# Altium schematic sheet Top Sheet.SchDoc: fddsa
size A4; DrawnBy: adsfaf; Engineer: afaffaf; Organization: sff; DocumentNumber: 1; Revision: 0; SheetNumber: 1; SheetTotal: 4; DocumentName: sfsfssf; ProjectName: sfsf
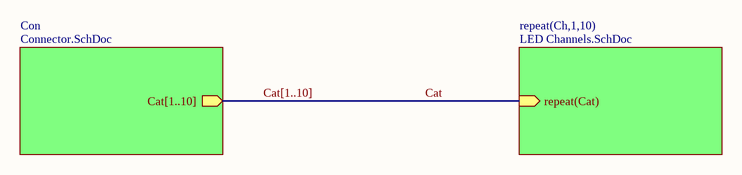
[diagram p0: Top Sheet.SchDoc]

## Sub-sheets
Con = Connector.SchDoc: Cat[1..10] (out)
repeat(Ch,1,10) = LED Channels.SchDoc: repeat(Cat) (in)

## Nets
Cat: sheet repeat(Ch,1,10)/repeat(Cat)

## Buses and harness runs
bus Cat[1..10] = sheet Con/Cat[1..10]